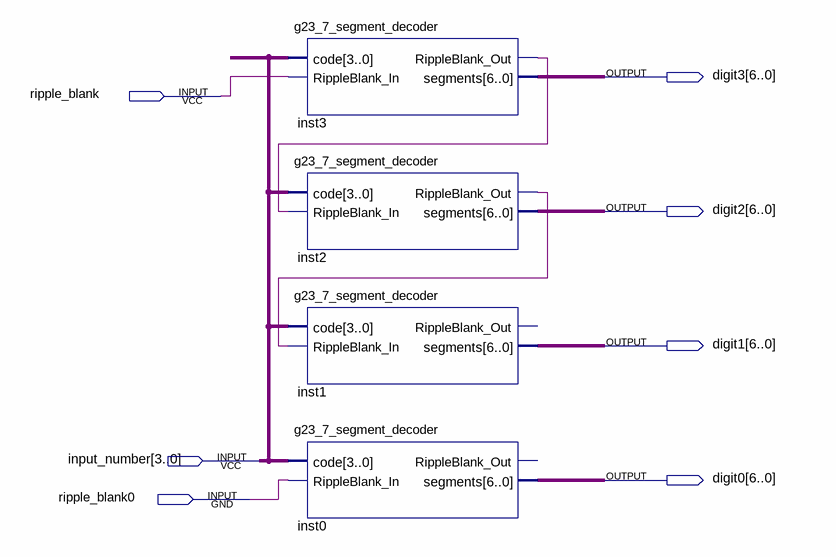
[diagram p0: schematic sheet]
// Quartus schematic g23_7_segment_decoder_tester.bdf as structural Verilog: 4 symbols, 7 pins
module g23_7_segment_decoder_tester (
  input  ripple_blank,
  input  [3:0] input_number,
  input  ripple_blank0,
  output [6:0] digit3,
  output [6:0] digit2,
  output [6:0] digit1,
  output [6:0] digit0
);

  wire inst2_rippleblank_out, inst3_rippleblank_out;

  g23_7_segment_decoder inst3 (
    .code(input_number), .RippleBlank_In(ripple_blank), .RippleBlank_Out(inst3_rippleblank_out),
    .segments(digit3));
  g23_7_segment_decoder inst2 (
    .code(input_number), .RippleBlank_In(inst3_rippleblank_out), .RippleBlank_Out(inst2_rippleblank_out),
    .segments(digit2));
  g23_7_segment_decoder inst1 (
    .code(input_number), .RippleBlank_In(inst2_rippleblank_out), .segments(digit1));  // open: RippleBlank_Out
  g23_7_segment_decoder inst0 (
    .code(input_number), .RippleBlank_In(ripple_blank0), .segments(digit0));  // open: RippleBlank_Out
endmodule
